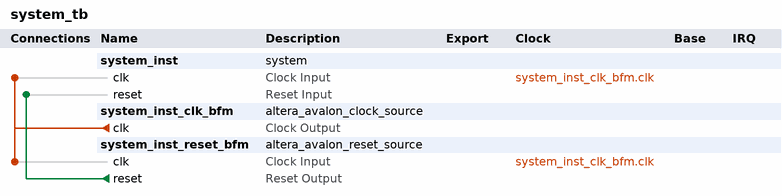
[diagram p0: system contents]
# Platform Designer (Qsys) system system_tb, Cyclone V 5CSXFC6D6F31C6
# Parameters at their usual value, and those the tool derives, are not listed.
package require -exact qsys 18.1
create_system system_tb
set_project_property DEVICE_FAMILY {Cyclone V}
set_project_property DEVICE 5CSXFC6D6F31C6

add_instance system_inst system 1.0

add_instance system_inst_clk_bfm altera_avalon_clock_source 18.1

add_instance system_inst_reset_bfm altera_avalon_reset_source 18.1
set_instance_parameter_value system_inst_reset_bfm ASSERT_HIGH_RESET 0
set_instance_parameter_value system_inst_reset_bfm INITIAL_RESET_CYCLES 50

# connections
add_connection system_inst_clk_bfm.clk system_inst.clk clock
add_connection system_inst_clk_bfm.clk system_inst_reset_bfm.clk clock
add_connection system_inst_reset_bfm.reset system_inst.reset reset

set_interconnect_requirement {$system} qsys_mm.clockCrossingAdapter HANDSHAKE
set_interconnect_requirement {$system} qsys_mm.enableEccProtection FALSE
set_interconnect_requirement {$system} qsys_mm.insertDefaultSlave FALSE
set_interconnect_requirement {$system} qsys_mm.maxAdditionalLatency 1

save_system system_tb.qsys
